# Altium schematic sheet 1_cyber60-alps_top.SchDoc: =ProjectTitle
size A4; Engineer: 4pplet; Address1: github.com/4pplet/cyber60; Address2: Licence: CERN-OHL-S; SheetNumber: 1; SheetTotal: 5; ProjectName: waffling60
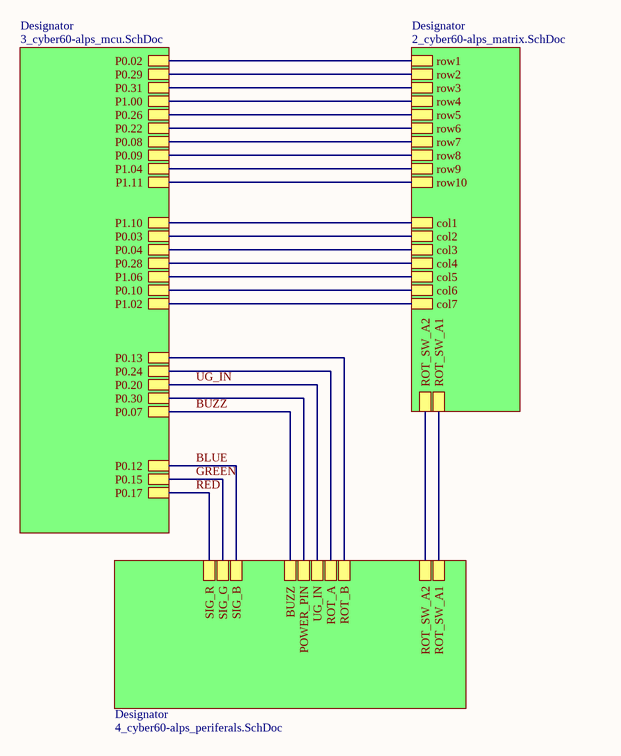
[diagram p0: 1_cyber60-alps_top.SchDoc]

## Sub-sheets
Designator = 3_cyber60-alps_mcu.SchDoc: P1.02, P1.04, P1.06, P1.11, P1.10, P0.07, P1.00, P0.22, P0.10, P0.09, P0.31, P0.29, P0.04, P0.02, P0.28, P0.20, P0.03, P0.26, P0.17, P0.15, P0.13, P0.24, P0.30, P0.12, P0.08
Designator = 2_cyber60-alps_matrix.SchDoc: col6, col5, col7, col3, col2, col1, col4, row3, row1, row4, row2, row5, row6, row9, row7, ROT_SW_A1, ROT_SW_A2, row8, row10
Designator = 4_cyber60-alps_periferals.SchDoc: ROT_SW_A2, ROT_B, ROT_A, ROT_SW_A1, POWER_PIN, BUZZ, SIG_B, SIG_R, SIG_G, UG_IN

## Nets
BLUE: sheet Designator/P0.12, sheet Designator/SIG_B
BUZZ: sheet Designator/P0.07, sheet Designator/BUZZ
GREEN: sheet Designator/P0.15, sheet Designator/SIG_G
RED: sheet Designator/P0.17, sheet Designator/SIG_R
UG_IN: sheet Designator/P0.20, sheet Designator/UG_IN
(unnamed): sheet Designator/P1.02, sheet Designator/col7
(unnamed): sheet Designator/P1.04, sheet Designator/row9
(unnamed): sheet Designator/P1.06, sheet Designator/col5
(unnamed): sheet Designator/P1.11, sheet Designator/row10
(unnamed): sheet Designator/P1.10, sheet Designator/col1
(unnamed): sheet Designator/P1.00, sheet Designator/row4
(unnamed): sheet Designator/P0.22, sheet Designator/row6
(unnamed): sheet Designator/P0.10, sheet Designator/col6
(unnamed): sheet Designator/P0.09, sheet Designator/row8
(unnamed): sheet Designator/P0.31, sheet Designator/row3
(unnamed): sheet Designator/P0.29, sheet Designator/row2
(unnamed): sheet Designator/P0.04, sheet Designator/col3
(unnamed): sheet Designator/P0.02, sheet Designator/row1
(unnamed): sheet Designator/P0.28, sheet Designator/col4
(unnamed): sheet Designator/P0.03, sheet Designator/col2
(unnamed): sheet Designator/P0.26, sheet Designator/row5
(unnamed): sheet Designator/P0.13, sheet Designator/ROT_B
(unnamed): sheet Designator/P0.24, sheet Designator/ROT_A
(unnamed): sheet Designator/P0.30, sheet Designator/POWER_PIN
(unnamed): sheet Designator/P0.08, sheet Designator/row7
(unnamed): sheet Designator/ROT_SW_A1, sheet Designator/ROT_SW_A1
(unnamed): sheet Designator/ROT_SW_A2, sheet Designator/ROT_SW_A2

## Notes on the sheet
- Title
- Size:
- Date:
- A4
- Number:
- Time:
- Revision:
- Sheet
- of
- File: